# Altium schematic sheet DATN_IoT_Node_Schenatic.SchDoc
size 594 x 420 mm; SheetNumber: 1; SheetTotal: 1; SPICEModelCacheKOELNJHK: <root> / <DocumentId>KOELNJHK</DocumentId> / <CacheFrame Number="0"> / <Model Name="diode" Kind="MDL"> / <Text>*Default Diode / *Diode Pinout: A,K / .MODEL DIODE D()</Text> / </Model> / </CacheFrame> / </root>
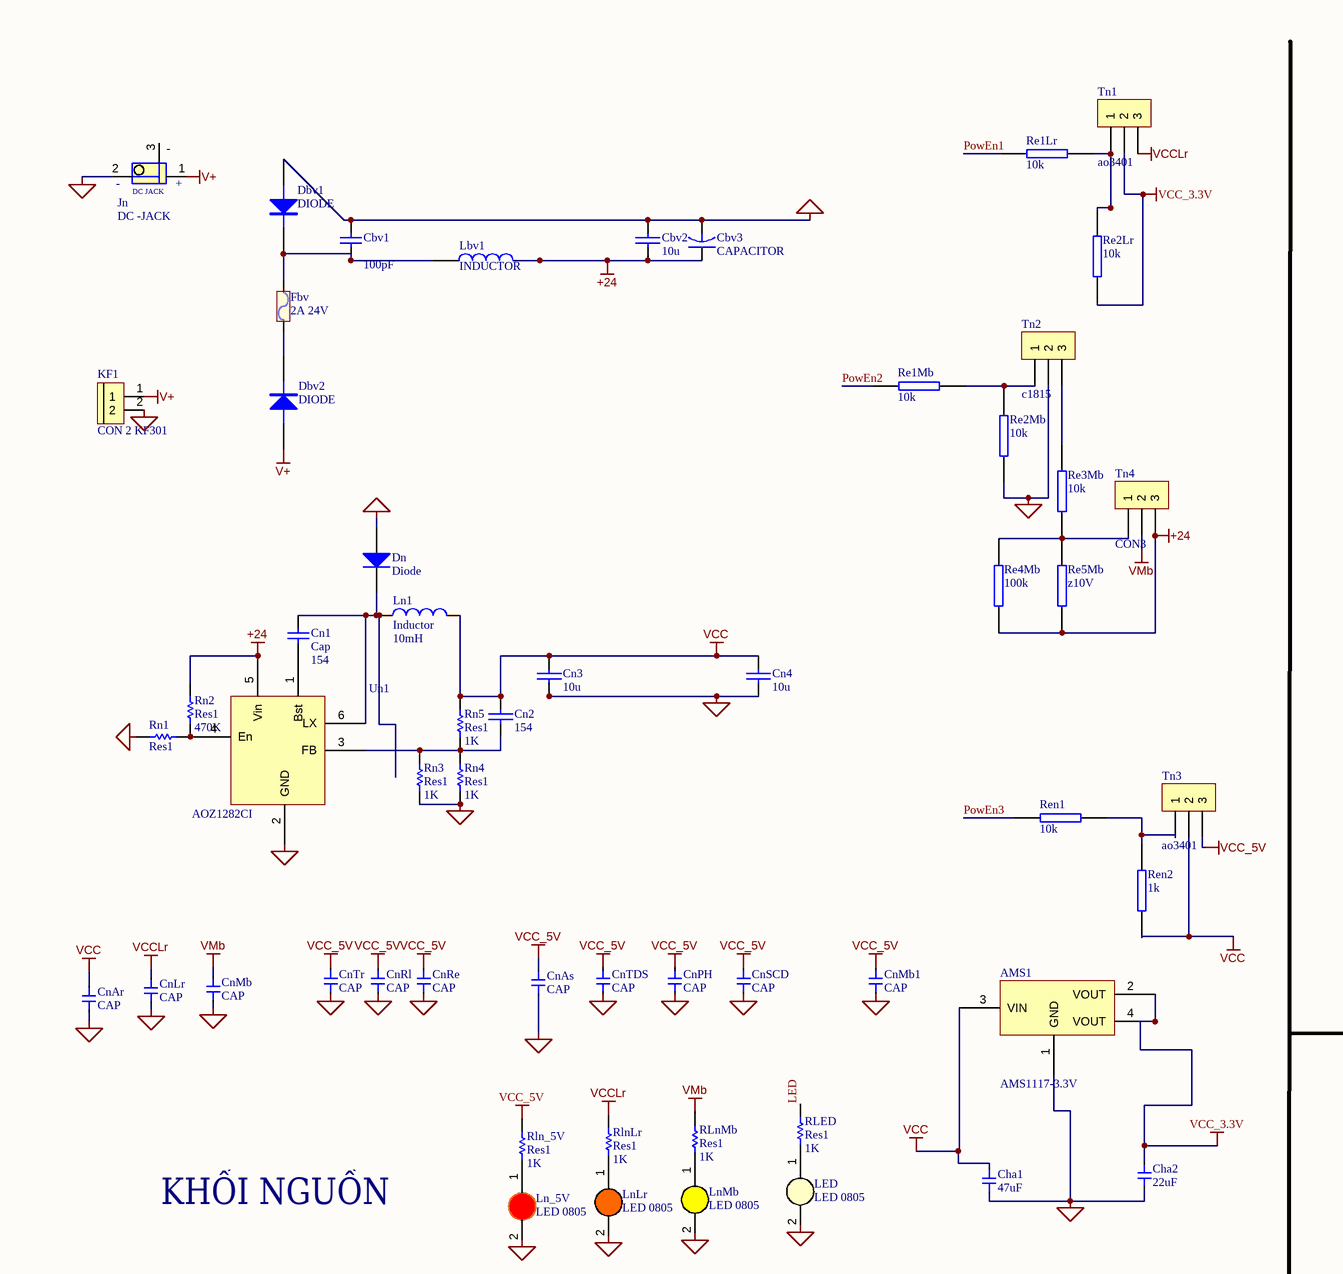
[diagram p0: DATN_IoT_Node_Schenatic.SchDoc, top left]
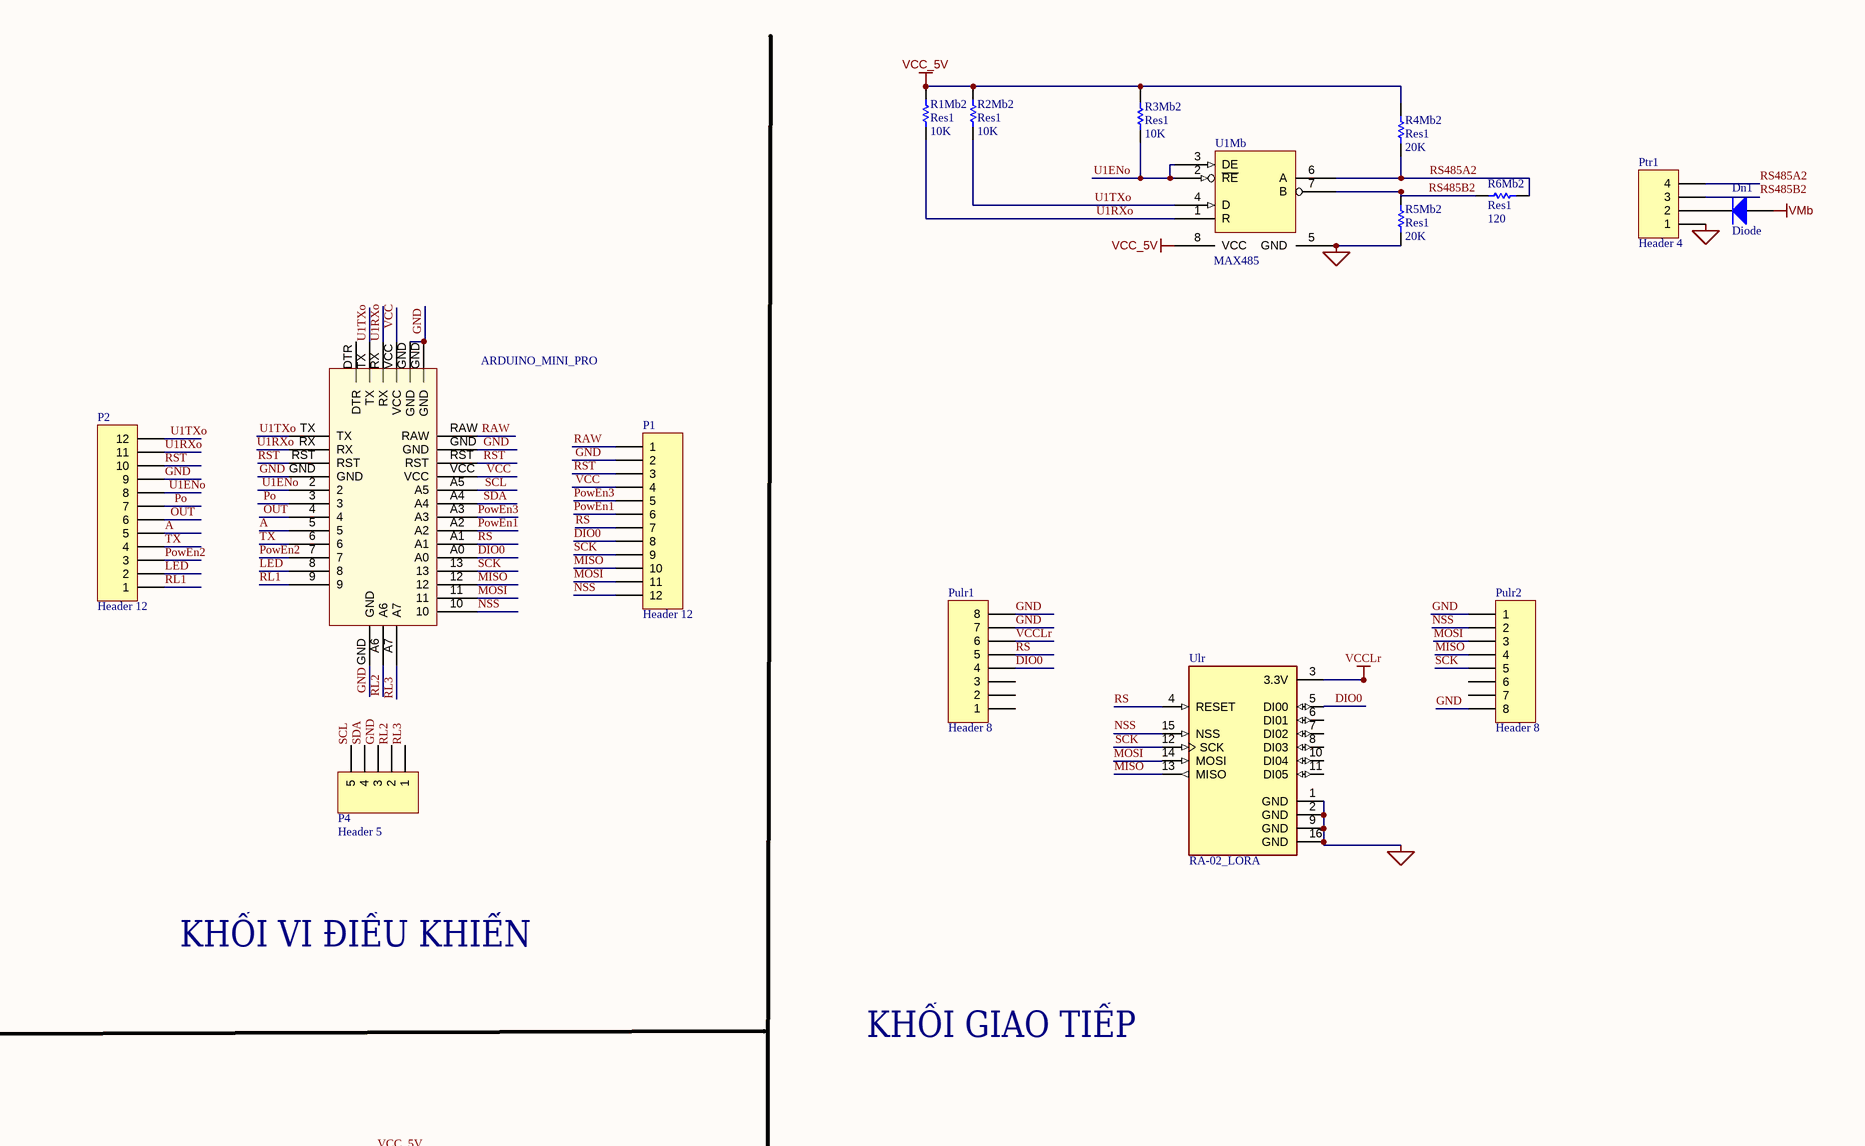
[diagram p1: DATN_IoT_Node_Schenatic.SchDoc, top right]
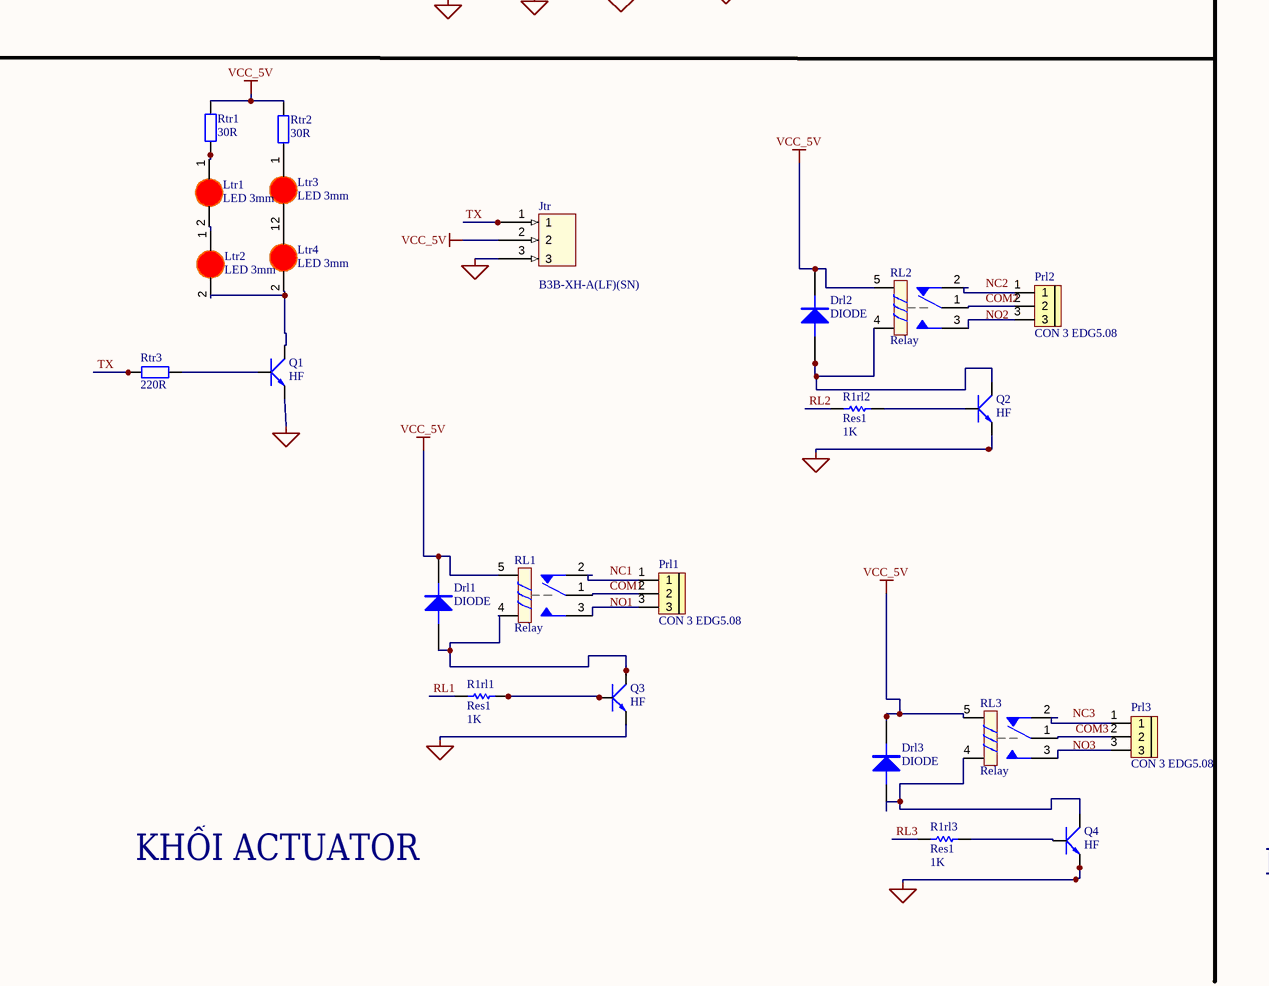
[diagram p2: DATN_IoT_Node_Schenatic.SchDoc, bottom left]
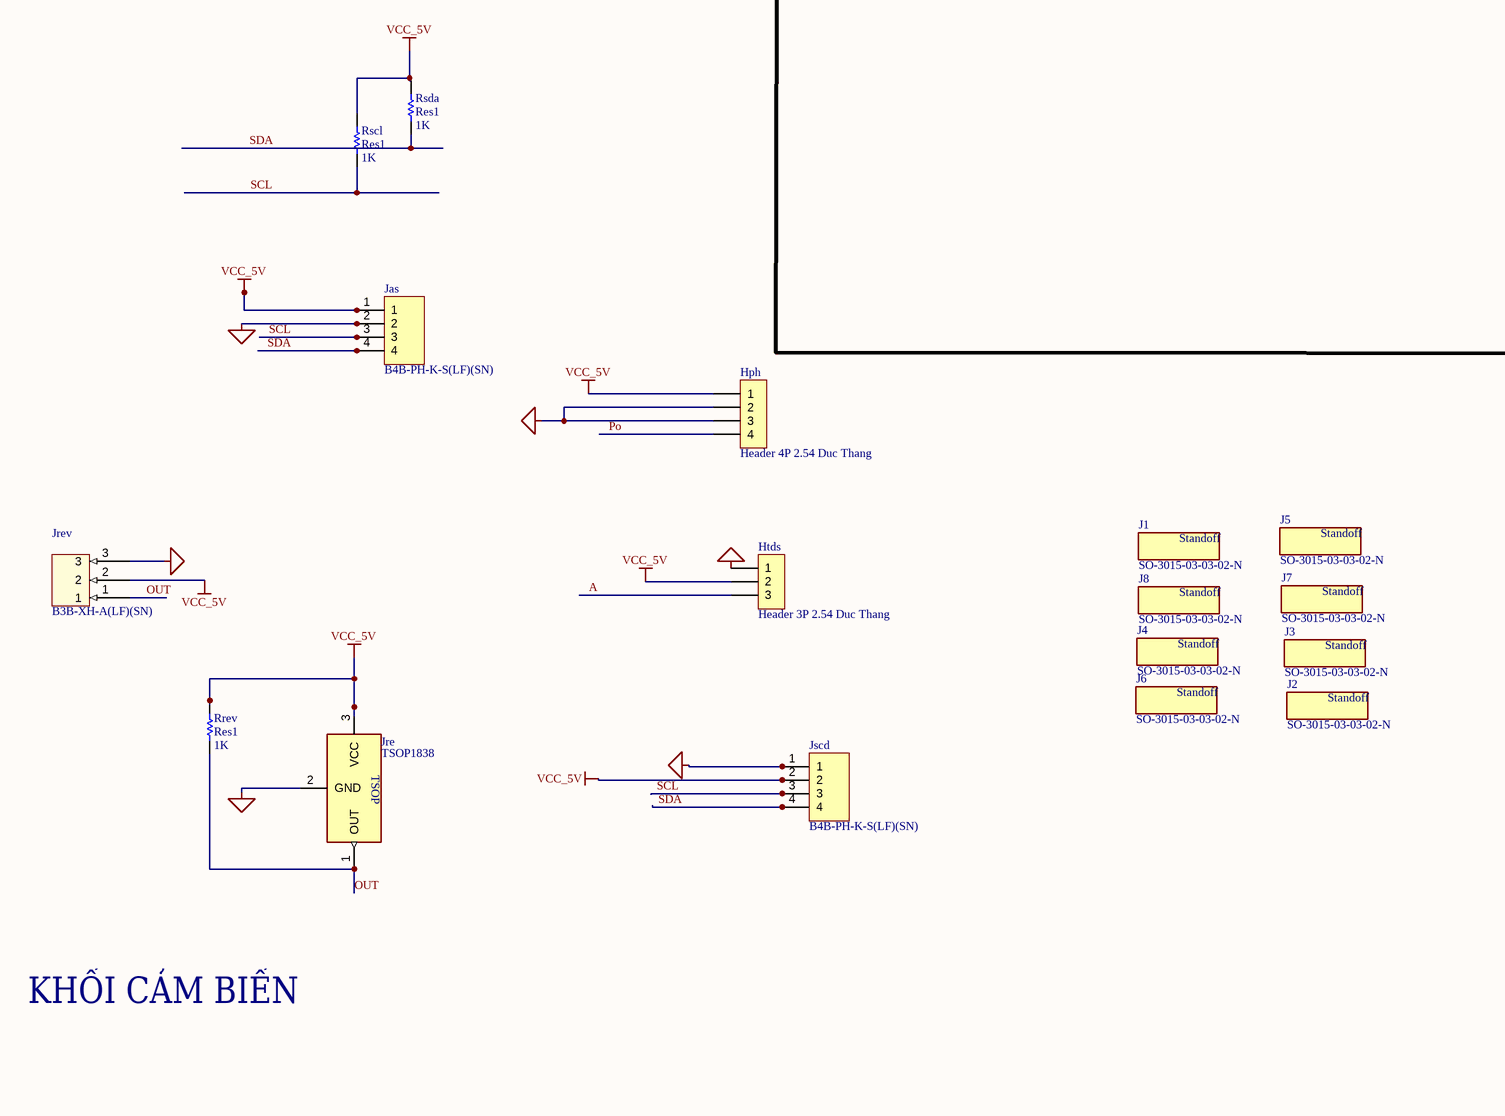
[diagram p3: DATN_IoT_Node_Schenatic.SchDoc, bottom right]

## Parts
AMS1  AMS1117-3.3V  [SOT223]
ARDUINO_MINI_PRO  ARDUINO_MINI_PRO  [ARDUINO_MINI_PRO]  (value not drawn)
Cbv1  value 100pF  [0805c]
Cbv2  10u  [1206e]
Cbv3  CAPACITOR  [cc15r15]
Cha1  47uF  [Cap 0805]
Cha2  22uF  [Cap 0805]
Cn1  Cap  value 154  [0805c]
Cn2  154  [1206e]
Cn3  10u  [1206e]
Cn4  10u  [1206e]
CnAr  CAP  [Cap 0805]
CnAs  CAP  [Cap 0805]
CnLr  CAP  [Cap 0805]
CnMb  CAP  [Cap 1206]
CnMb1  CAP  [Cap 0805]
CnPH  CAP  [Cap 0805]
CnRe  CAP  [Cap 0805]
CnRl  CAP  [Cap 0805]
CnSCD  CAP  [Cap 0805]
CnTDS  CAP  [Cap 0805]
CnTr  CAP  [Cap 0805]
Dbv1  DIODE  [smb]
Dbv2  DIODE  [sma]
Dn  Diode  [Sma]
Dn1  Diode  [Sma]
Drl1  DIODE  [sma]
Drl2  DIODE  [sma]
Drl3  DIODE  [sma]
Fbv  2A 24V  [Cau chi tu phuc hoi 2A 24V SMD1812]
Hph  Header 4P 2.54 Duc Thang  [XH2.54M-4]
Htds  Header 3P 2.54 Duc Thang  [XH2.54M-3]
J1  SO-3015-03-03-02-N  [SAMTEC_SO-3015-03-03-02-N]
J2  SO-3015-03-03-02-N  [SAMTEC_SO-3015-03-03-02-N]
J3  SO-3015-03-03-02-N  [SAMTEC_SO-3015-03-03-02-N]
J4  SO-3015-03-03-02-N  [SAMTEC_SO-3015-03-03-02-N]
J5  SO-3015-03-03-02-N  [SAMTEC_SO-3015-03-03-02-N]
J6  SO-3015-03-03-02-N  [SAMTEC_SO-3015-03-03-02-N]
J7  SO-3015-03-03-02-N  [SAMTEC_SO-3015-03-03-02-N]
J8  SO-3015-03-03-02-N  [SAMTEC_SO-3015-03-03-02-N]
Jas  B4B-PH-K-S(LF)(SN)  [CON4_78_B4B-PH-K-S(LF)(SN)]
Jn  DC -JACK  [CON3_129_PJ-002A_TH_RA]
Jre  TSOP1838  [TSOP1838]
Jrev  B3B-XH-A(LF)(SN)  [CON3_100_B3B-XH-A_TH_ST]
Jscd  B4B-PH-K-S(LF)(SN)  [CON4_78_B4B-PH-K-S(LF)(SN)]
Jtr  B3B-XH-A(LF)(SN)  [CON3_100_B3B-XH-A_TH_ST]
KF1  CON 2 KF301  [Con 2 KF301 5.08]
Lbv1  INDUCTOR  [IND_SPR05x]
LED  LED 0805  [LED-0805-Yellow]
Ln1  Inductor  value 10mH  [IND_SPR06xe]
Ln_5V  LED 0805  [LED-0805-Red]
LnLr  LED 0805  [LED-0805-Orange]
LnMb  LED 0805  [LED-0805-Yellow]
Ltr1  LED 3mm  [LED-3MM-RED]
Ltr2  LED 3mm  [LED-3MM-RED]
Ltr3  LED 3mm  [LED-3MM-RED]
Ltr4  LED 3mm  [LED-3MM-RED]
P1  Header 12  [HDR1X12]
P2  Header 12  [HDR1X12]
P4  Header 5  [HDR1X5]
Prl1  CON 3 EDG5.08  [CON 3 3EDG5.08]
Prl2  CON 3 EDG5.08  [CON 3 3EDG5.08]
Prl3  CON 3 EDG5.08  [CON 3 3EDG5.08]
Ptr1  Header 4  [giacdung4]
Pulr1  Header 8  [HDR1X8]
Pulr2  Header 8  [HDR1X8]
Q1  HF  [SOT-23]
Q2  HF  [SOT-23]
Q3  HF  [SOT-23]
Q4  HF  [SOT-23]
R1Mb2  Res1  value 10K  [0805c]
R1rl1  Res1  value 1K  [0805c]
R1rl2  Res1  value 1K  [0805c]
R1rl3  Res1  value 1K  [0805c]
R2Mb2  Res1  value 10K  [0805c]
R3Mb2  Res1  value 10K  [0805c]
R4Mb2  Res1  value 20K  [0805c]
R5Mb2  Res1  value 20K  [0805c]
R6Mb2  Res1  value 120  [0805c]
Re1Lr  10k  [0805c]
Re1Mb  10k  [0805c]
Re2Lr  10k  [0805c]
Re2Mb  10k  [0805c]
Re3Mb  10k  [0805c]
Re4Mb  100k  [0805c]
Re5Mb  z10V  [1206]
Ren1  10k  [0805c]
Ren2  1k  [0805c]
RL1  Relay  [Relay 5 Chan SRD]
RL2  Relay  [Relay 5 Chan SRD]
RL3  Relay  [Relay 5 Chan SRD]
RLED  Res1  value 1K  [0805c]
Rln_5V  Res1  value 1K  [0805c]
RlnLr  Res1  value 1K  [0805c]
RLnMb  Res1  value 1K  [0805c]
Rn1  Res1  [0805c]
Rn2  Res1  value 470K  [0805c]
Rn3  Res1  value 1K  [0805c]
Rn4  Res1  value 1K  [0805c]
Rn5  Res1  value 1K  [0805c]
Rrev  Res1  value 1K  [0805c]
Rscl  Res1  value 1K  [0805c]
Rsda  Res1  value 1K  [0805c]
Rtr1  30R  [tro smd 0805]
Rtr2  30R  [tro smd 0805]
Rtr3  220R  [tro smd 0805]
Tn1  ao3401  [sot23-3]
Tn2  c1815  [sot23-3]
Tn3  ao3401  [sot23-3]
Tn4  CON3  [dpak]
U1Mb  MAX485  [so-8]
Ulr  RA-02_LORA  [MODULE_RA-02_LORA]
Un1  AOZ1282CI  [Sot23-6]

## Nets
+24: Cbv2.1 Cbv3.1 Lbv1.2 Re4Mb.1 Re5Mb.1 Rn2.1 Tn4.3 Un1.5(Vin)
GND: AMS1.1(GND) ARDUINO_MINI_PRO.GND Cbv1.2 Cbv2.2 Cbv3.2 Cha1.2 Cha2.2 Cn3.2 Cn4.2 CnAr.2 CnAs.2 CnLr.2 CnMb.2 CnMb1.2 CnPH.2 CnRe.2 CnRl.2 CnSCD.2 CnTDS.2 CnTr.2 Dbv1.1(A) Dn.1(A) Hph.2 Hph.3 Htds.1 Jas.2 Jn.2 Jre.2(GND) Jrev.3 Jscd.1 Jtr.3 KF1.2 LED.2(K) Ln_5V.2(K) LnLr.2(K) LnMb.2(K) P1.2 P2.9 P4.3 Ptr1.1 Pulr1.7 Pulr1.8 Pulr2.1 Pulr2.8 Q1.2(E) Q2.2(E) Q3.2(E) Q4.2(E) R5Mb2.1 Re2Mb.1 Rn1.1 Rn3.1 Rn4.1 Tn2.2 U1Mb.5(GND) Ulr.1(GND) Ulr.2(GND) Ulr.9(GND) Ulr.16(GND) Un1.2(GND)
V+: Dbv2.1(A) Jn.1 KF1.1
VCC: AMS1.3(VIN) ARDUINO_MINI_PRO.VCC Cha1.1 Cn2.1 Cn3.1 Cn4.1 CnAr.1 CnAs.1 CnMb1.1 CnPH.1 CnRe.1 CnRl.1 CnSCD.1 CnTDS.1 CnTr.1 Drl1.2(K) Drl2.2(K) Drl3.2(K) Hph.1 Htds.2 Jas.1 Jre.3(VCC) Jrev.2 Jscd.2 Jtr.2 Ln1.2 P1.4 R1Mb2.1 R2Mb2.1 R3Mb2.1 R4Mb2.1 Ren2.2 RL1.5 RL2.5 RL3.5 Rln_5V.2 Rn5.1 Rrev.2 Rscl.2 Rsda.2 Rtr1.1 Rtr2.1 Tn3.2 Tn3.3 U1Mb.8(VCC)  [also labelled VCC_5V]
VCC_3.3V: AMS1.2(VOUT) AMS1.4(VOUT) Cha2.1 Re2Lr.2 Tn1.2
VCCLr: CnLr.1 Pulr1.6 RlnLr.2 Tn1.3 Ulr.3(3.3V)
VMb: CnMb.1 Dn1.1(A) RLnMb.2 Tn4.2
A: ARDUINO_MINI_PRO.5 Htds.3 P2.5
COM1: Prl1.2 RL1.1
COM2: Prl2.2 RL2.1
COM3: Prl3.2 RL3.1
DIO0: ARDUINO_MINI_PRO.A0 P1.8 Pulr1.4 Ulr.5(DI00)
LED: ARDUINO_MINI_PRO.8 P2.2 RLED.2
MISO: ARDUINO_MINI_PRO.12 P1.10 Pulr2.4 Ulr.13(MISO)
MOSI: ARDUINO_MINI_PRO.11 P1.11 Pulr2.3 Ulr.14(MOSI)
NSS: ARDUINO_MINI_PRO.10 P1.12 Pulr2.2 Ulr.15(NSS)
OUT: ARDUINO_MINI_PRO.4 Jre.1(OUT) Jrev.1 P2.6 Rrev.1
Po: ARDUINO_MINI_PRO.3 Hph.4 P2.7
PowEn1: ARDUINO_MINI_PRO.A2 P1.6 Re1Lr.1
PowEn2: ARDUINO_MINI_PRO.7 P2.3 Re1Mb.1
PowEn3: ARDUINO_MINI_PRO.A3 P1.5 Ren1.1
RAW: ARDUINO_MINI_PRO.RAW P1.1
RL1: ARDUINO_MINI_PRO.9 P2.1 R1rl1.1
RL2: ARDUINO_MINI_PRO.A6 P4.2 R1rl2.1
RL3: ARDUINO_MINI_PRO.A7 P4.1 R1rl3.1
RS: ARDUINO_MINI_PRO.A1 P1.7 Pulr1.5 Ulr.4(RESET)
RS485A2: Ptr1.4 R4Mb2.2 R6Mb2.2 U1Mb.6(A)
RS485B2: Ptr1.3 R5Mb2.2 R6Mb2.1 U1Mb.7(B)
RST: ARDUINO_MINI_PRO.RST P1.3 P2.10
SCK: ARDUINO_MINI_PRO.13 P1.9 Pulr2.5 Ulr.12(SCK)
SCL: ARDUINO_MINI_PRO.A5 Jas.3 Jscd.3 P4.5 Rscl.1
SDA: ARDUINO_MINI_PRO.A4 Jas.4 Jscd.4 P4.4 Rsda.1
TX: ARDUINO_MINI_PRO.6 Jtr.1 P2.4 Rtr3.1
U1ENo: ARDUINO_MINI_PRO.2 P2.8 R3Mb2.2 U1Mb.2(~{RE}) U1Mb.3(DE)
U1RXo: ARDUINO_MINI_PRO.RX P2.11 R1Mb2.2 U1Mb.1(R)
U1TXo: ARDUINO_MINI_PRO.TX P2.12 R2Mb2.2 U1Mb.4(D)
NetCbv1_1: Cbv1.1 Dbv1.2(K) Fbv.1 Lbv1.1
NetCn1_1: Cn1.1 Un1.1(Bst)
NetCn1_2: Cn1.2 Dn.2(K) Ln1.1 Un1.6(LX)
NetCn2_2: Cn2.2 Rn3.2 Rn4.2 Rn5.2 Un1.3(FB)
NetDbv2_2: Dbv2.2(K) Fbv.2
NetDn1_2: Dn1.2(K) Ptr1.2
NetDrl1_1: Drl1.1(A) Q3.3(C) RL1.4
NetDrl2_1: Drl2.1(A) Q2.3(C) RL2.4
NetDrl3_1: Drl3.1(A) Q4.3(C) RL3.4
NetLED_1: LED.1(A) RLED.1
NetLn_5V_1: Ln_5V.1(A) Rln_5V.1
NetLnLr_1: LnLr.1(A) RlnLr.1
NetLnMb_1: LnMb.1(A) RLnMb.1
NetLtr1_1: Ltr1.1(A) Rtr1.2
NetLtr1_2: Ltr1.2(K) Ltr2.1(A)
NetLtr2_2: Ltr2.2(K) Ltr4.2(K) Q1.3(C)
NetLtr3_1: Ltr3.1(A) Rtr2.2
NetLtr3_2: Ltr3.2(K) Ltr4.1(A)
NetPrl1_1: Prl1.1 RL1.2
NetPrl1_3: Prl1.3 RL1.3
NetPrl2_1: Prl2.1 RL2.2
NetPrl2_3: Prl2.3 RL2.3
NetPrl3_1: Prl3.1 RL3.2
NetPrl3_3: Prl3.3 RL3.3
NetQ1_1: Q1.1(B) Rtr3.2
NetQ2_1: Q2.1(B) R1rl2.2
NetQ3_1: Q3.1(B) R1rl1.2
NetQ4_1: Q4.1(B) R1rl3.2
NetRe1Lr_2: Re1Lr.2 Re2Lr.1 Tn1.1
NetRe1Mb_2: Re1Mb.2 Re2Mb.2 Tn2.1
NetRe3Mb_1: Re3Mb.1 Tn2.3
NetRe3Mb_2: Re3Mb.2 Re4Mb.2 Re5Mb.2 Tn4.1
NetRen1_2: Ren1.2 Ren2.1 Tn3.1
NetRn1_2: Rn1.2 Rn2.2 Un1.4(En)

Not connected (* = marked no-connect by the designer): ARDUINO_MINI_PRO DTR; Jn 3(-); Pulr1 1 2 3; Pulr2 6 7; Ulr 6(DI01) 7(DI02) 8(DI03) 10(DI04) 11(DI05)

## Notes on the sheet
- KHỐI VI ĐIỀU KHIỂN
- KHỐI GIAO TIẾP
- KHỐI NGUỒN
- KHỐI ACTUATOR
- KHỐI CẢM BIẾN
- Labels drawn without touching a wire or pin: NC1, NC2, NC3, NO1, NO2, NO3
- DWG NO:
- REV:
- THIS DOCUMENT AND THE DATA DISCLOSED HEREIN OR
- HEREWITH IS THE PROPERTY OF ALTIUM LIMITED AND MAY
- BE FREELY DISTRIBUTED IN WHOLE. NO RIGHTS ARE
- RESERVED OR EXPRESS OR IMPLIED WARANTEE GIVEN.
- REVISION
- DESCRIPTION
- DATE
- APPROVED
- ENG:
- APPROVALS
- PROJECT
- DSN:
- CHK:
- REFERENCE DOCUMENTS
- PROJECT REVISION:
- TITLE
- DOCUMENT REVISION:
- DESIGN ITEM:
- BOM:
- FAB DWG:
- PCB DWG:
- ASSY DWG:
- SCALE:
- A2
- SIZE
- CAGE CODE
- FILE NAME
- DWG NO.
- SHEET
- OF
- REV
- (in symbol CON-PLG_3X1-228-DC_JACK) +; DC JACK
- (in symbol SO-3015-03-03-02-N) Standoff
- (in symbol TSOP1838) TSOP

## Library data of the parts
AMS1 = AMS1117 SMD: Dán; Value: AMS1117-3.3V SOT223; Don_Vi: Con; Ma_Hang: MH000596; Ghi_Chu: *; Kieu_Chan: *; Chung_Loai: Dán
Cbv1 Cn1 = Cap: Capacitor; Published: 8-Jun-2000; LatestRevisionDate: 17-Jul-2002; LatestRevisionNote: Re-released for DXP Platform.; PackageReference: RAD-0.3; Publisher: Altium Limited
Cbv2 Cn2-Cn4 = CAP: Capacitor
Cha1 Cha2 CnAr CnAs CnLr CnMb1 CnPH CnRe CnRl CnSCD CnTDS CnTr = Cap 0805: Capacitor SMD 0805
CnMb = Cap 1206: Capacitor SMD 1206
Dn Dn1 = Diode: Default Diode; Published: 8-Jun-2000; LatestRevisionDate: 17-Jul-2002; LatestRevisionNote: Re-released for DXP Platform.; PackageVersion: Sep-1996; PackageReference: SMC; Publisher: Altium Limited; Code_JEDEC: DO-214-AB
Fbv = Cau chi tu phuc hoi 2A 24V SMD1812: 2A 24V SMD1812; Ma_Hang: MH010033; Ten: Cầu Chì Tự Phục Hồi 2A 24V SMD1812
Hph = Header 4P 2.54 Duc Thang: Cắm; Ten_Linh_Kien: Header 4P XH2.54-4P Đực Thẳng; Don_Vi: Con; Ma_Hang: MH001285; Chung_Loai: Cắm
Htds = Header 3P 2.54 Duc Thang: Cắm; Ten_Linh_Kien: Header 3P XH2.54-3P Đực Thẳng; Don_Vi: Con; Ma_Hang: MH001292; Chung_Loai: Cắm
J1-J8 = SO-3015-03-03-02-N: Precision Board Stacking Standoff; MF: Samtec; SnapEDA_Link: https://www.snapeda.com/parts/SO-3015-03-03-02-N/Samtec/view-part/?ref=snap; Package: None; Value: *; MP: SO-3015-03-03-02-N; Check_prices: https://www.snapeda.com/parts/SO-3015-03-03-02-N/Samtec/view-part/?ref=eda
Jas Jscd = CON-PLG_4X1-78-ST-TH: Connector Header Through Hole 4 position 0.079" (2.00mm); Manufacturer: JST; Mating Part Number: PHR-4; Crimp Part Number: ASPHSPH24K51; Alternate Part Number-1: NA; Manufacturer Part Number: B4B-PH-K-S(LF)(SN); Case/Package: TH; Supplier-1: SP Road; Supplier Part Number-1: NA
Jn = CON-PLG_3X1-228-DC_JACK: 3 Pins, 1 Row 228mil Pitch, right angle Connector, male; Manufacturer: JST; Manufacturer Part Number: PJ-002A; Alternate Part Number-1: NA; Case/Package: TH-CON; Supplier-1: SP ROAD; Supplier Part Number-1: NA
Jre = TSOP1838: IR Remote Receiver 38KHz 35m 3-Pin; MF: Vishay; SnapEDA_Link: https://www.snapeda.com/parts/TSOP1838/Vishay/view-part/?ref=snap; Package: None; Value: *; MP: TSOP1838; Check_prices: https://www.snapeda.com/parts/TSOP1838/Vishay/view-part/?ref=eda
Jrev Jtr = CON-PLG_3X1-100-ST-TH: 3 Pins, 1 Row 2.54mm Pitch, straight Connector, male; Manufacturer: CUI; Mating Part Number: XHP-3; Crimp Part Number: ASXHSXH22K51; Alternate Part Number-1: NA; Manufacturer Part Number: B3B-XH-A(LF)(SN); Case/Package: TH-CON; Supplier-1: ARROW; Supplier Part Number-1: B3B-XH-A(LF)(SN)
KF1 = CON 2 KF301: Cắm; Ma_Hang: MH000987; Ten_Linh_Kien: CON 2 KF301-2P 5.08MM Xanh Dương; Chung_Loai: Cắm; Ghi_Chu: *; Kieu_Chan: *; Don_Vi: Con
LED = LED 0805 Trang: Dán; Don_Vi: Con; Ma_Hang: MH002946; Ten_Linh_Kien: LED 0805 Màu Trắng ( White); Ghi_Chu: *; Kieu_Chan: *; Chung_Loai: Dán
Ln1 = Inductor: Code_IEC: 1005; Published: 8-Jun-2000; LatestRevisionDate: 29-May-2009; LatestRevisionNote: IPC-7351 Footprint Added.; PackageReference: 0402-A; Publisher: Altium Limited; PackageDescription: Chip Inductor; Code_JEITA: 0402
Ln_5V = LED 0805 Do: Dán; Don_Vi: Con; Ma_Hang: MH000897; Ten_Linh_Kien: LED 0805 Màu Đỏ (Red); Ghi_Chu: *; Kieu_Chan: *; Chung_Loai: Dán
LnLr = LED 0805 Cam: Dán; Don_Vi: Con; Ma_Hang: MH002328; Ten_Linh_Kien: LED 0805 Màu Cam ( Orange); Ghi_Chu: *; Kieu_Chan: *; Chung_Loai: Dán
LnMb = LED 0805 Vang: Dán; Don_Vi: Con; Ma_Hang: MH002329; Ten_Linh_Kien: LED 0805 Màu Vàng ( Yellow); Ghi_Chu: *; Kieu_Chan: *; Chung_Loai: Dán
Ltr1-Ltr4 = LED 3mm Do: Cắm; Don_Vi: Con; Ma_Hang: MH003892; Ten_Linh_Kien: Led 3MM Phủ Đỏ (10c); Ghi_Chu: *; Kieu_Chan: *; Chung_Loai: Cắm
P1 P2 = Header 12: Header, 12-Pin; LatestRevisionDate: 17-Jul-2002; LatestRevisionNote: Re-released for DXP Platform.; Publisher: Altium Limited
P4 = Header 5: Header, 5-Pin; LatestRevisionDate: 17-Jul-2002; LatestRevisionNote: Re-released for DXP Platform.; Publisher: Altium Limited
Prl1-Prl3 = CON 3 EDG5.08: Cắm; Ten_Linh_Kien: CON 3 2EDG5.08-3P 5.08MM ( Xanh Cong); Ma_Hang: MH000760; Ghi_Chu: *; Kieu_Chan: *; Don_Vi: Con; Chung_Loai: Cắm
Ptr1 = Header 4: Header, 4-Pin; LatestRevisionDate: 17-Jul-2002; LatestRevisionNote: Re-released for DXP Platform.; Publisher: Altium Limited
Pulr1 Pulr2 = Header 8: Header, 8-Pin; LatestRevisionDate: 17-Jul-2002; LatestRevisionNote: Re-released for DXP Platform.; Publisher: Altium Limited
Q1-Q4 = Trans C1815 HF SMD: SOT-23; Value: C9014
R1Mb2 R1rl1-R1rl3 R2Mb2 R3Mb2 R4Mb2 R5Mb2 R6Mb2 RLED Rln_5V RlnLr RLnMb Rn1-Rn5 Rrev Rscl Rsda = Res1: Resistor; Published: 8-Jun-2000; LatestRevisionDate: 17-Jul-2002; LatestRevisionNote: Re-released for DXP Platform.; PackageReference: AXIAL-0.3; Publisher: Altium Limited
Re1Lr Re1Mb Re2Lr Re2Mb Re3Mb Re4Mb Re5Mb Ren1 Ren2 = RES2
RL1-RL3 = Relay 5 Chan SRD: Relay 5 Chan; Ma_Hang: MH009374; Ten: Relay 5V10A SRD-05VDC-SL-C Chính Hãng
Rtr1 Rtr2 = Tro 0805 5% 30R: Dán; Don_Vi: Con; So_Chan: 2; Ten_Linh_Kien: Trở 0805 5% 30R; Ma_Hang: MH005315; Chung_Loai: Dán; Kieu_Chan: *
Rtr3 = Tro 0805 5% 220R: Dán; Don_Vi: Con; So_Chan: 2; Ten_Linh_Kien: Trở 0805 5% 220R; Ma_Hang: MH005259; Chung_Loai: Dán; Kieu_Chan: *
Tn1-Tn4 = CON3: Connector
U1Mb = DS36F95: DIFFERENTIAL BUS TRANSCEIVERS
Ulr = RA-02_LORA: Ra-02 LoRa RF M5Stack Platform Evaluation Expansion Board; Price: None; Availability: Unavailable; MP: RA-02_LORA; Value: *; Package: None
Un1 = AOZ1282CI: AOZ1282